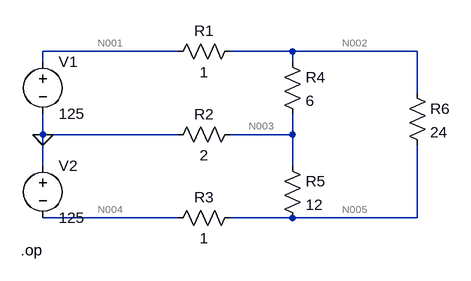
[diagram p0: schematic Draft2.asc]
Draft2.asc, the LTspice schematic file:
Version 4
SHEET 1 880 680
WIRE 320 160 112 160
WIRE 496 160 400 160
WIRE 688 160 496 160
WIRE 112 176 112 160
WIRE 496 176 496 160
WIRE 688 224 688 160
WIRE 112 288 112 256
WIRE 320 288 112 288
WIRE 496 288 496 256
WIRE 496 288 400 288
WIRE 112 336 112 288
WIRE 496 336 496 288
WIRE 320 416 112 416
WIRE 496 416 400 416
WIRE 688 416 688 304
WIRE 688 416 496 416
FLAG 112 288 0
DATAFLAG 112 256 ""
DATAFLAG 112 320 ""
DATAFLAG 288 416 ""
DATAFLAG 272 160 ""
DATAFLAG 496 288 ""
DATAFLAG 496 160 ""
DATAFLAG 496 416 ""
SYMBOL voltage 112 160 R0
WINDOW 123 0 0 Left 0
WINDOW 39 0 0 Left 0
SYMATTR InstName V1
SYMATTR Value 125
SYMBOL voltage 112 320 R0
WINDOW 123 0 0 Left 0
WINDOW 39 0 0 Left 0
SYMATTR InstName V2
SYMATTR Value 125
SYMBOL res 416 144 R90
WINDOW 0 0 56 VBottom 2
WINDOW 3 32 56 VTop 2
SYMATTR InstName R1
SYMATTR Value 1
SYMBOL res 416 272 R90
WINDOW 0 0 56 VBottom 2
WINDOW 3 32 56 VTop 2
SYMATTR InstName R2
SYMATTR Value 2
SYMBOL res 416 400 R90
WINDOW 0 0 56 VBottom 2
WINDOW 3 32 56 VTop 2
SYMATTR InstName R3
SYMATTR Value 1
SYMBOL res 480 160 R0
SYMATTR InstName R4
SYMATTR Value 6
SYMBOL res 480 320 R0
SYMATTR InstName R5
SYMATTR Value 12
SYMBOL res 672 208 R0
SYMATTR InstName R6
SYMATTR Value 24
TEXT 78 466 Left 2 !.op

The netlist it stands for:
* Draft2.asc
V1 N001 0 125
V2 0 N004 125
R1 N002 N001 1
R2 N003 0 2
R3 N005 N004 1
R4 N002 N003 6
R5 N003 N005 12
R6 N002 N005 24
.op
.backanno
.end

* Results of the author's LTspice run, read from the files saved beside the schematic
* Operating Point:
*   V(n001) = 125 V
*   V(n004) = -125 V
*   V(n002) = 101.2 V
*   V(n003) = 10.66 V
*   V(n005) = -106.6 V
*   I(R6) = 8.659 A
*   I(R5) = 9.769 A
*   I(R4) = 15.1 A
*   I(R3) = 18.43 A
*   I(R2) = 5.329 A
*   I(R1) = -23.76 A
*   I(V2) = -18.43 A
*   I(V1) = -23.76 A